# EAGLE design voltage_control (EAGLE 9.0.1)
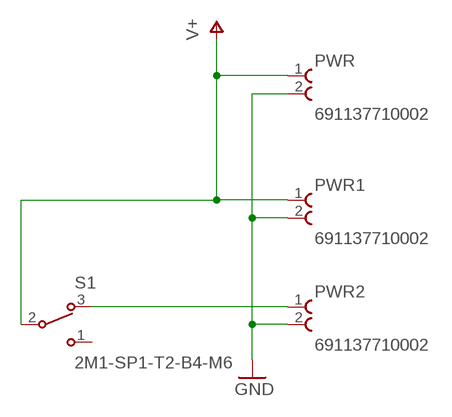
[diagram p0: schematic, sheet 1]

## Parts
PWR  691137710002  [691137710002]
PWR1  691137710002  [691137710002]
PWR2  691137710002  [691137710002]
S1  2M1-SP1-T2-B4-M6  [2M1-SP1-T2-B4-M6]

## Nets
GND: PWR1.2 PWR2.2 PWR.2
N$1: PWR2.1 S1.3(O)
V+: PWR1.1 PWR.1 S1.2(P)
Unconnected: S1.1(S)

## Library data of the parts
PWR PWR1 PWR2 = term block:691137710002: SERIE 1377 - 5.00 MM - HORIZONTAL CABLE ENTRY WITH PRESSURE CLAMP - GLOW WIRE PLASTIC - WR-TBL <http://katalog.we-online.de/media/images/v2/Family_WR-TBL1_6911377100xx.jpg> Details see: http://katalog.we-online.de/en/em/TBL_5_00_1377_HORIZONTAL_ENTRY_W_PRESSURE_CLAMP_GLOW_WIRE_6911377100xx Created by Yingchun,Shan 2016(C) Wurth Elektronik; AVAILABILITY: Unavailable; DESCRIPTION: Term Block 2pos Side Entry 5mm; MF: Wurth Electronics; MP: 691137710002; PACKAGE: None; PRICE: None
S1 = switch-ck:2M1-SP1-T2-B4-M6: TOGGLE SWITCH

## Board
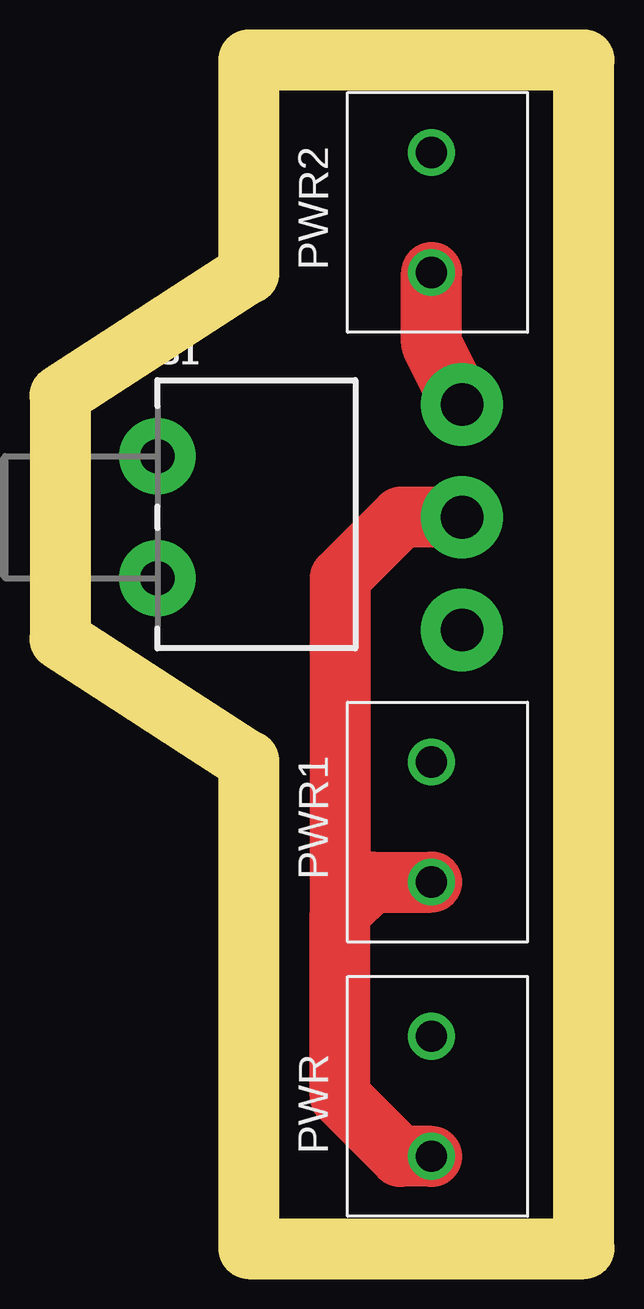
[diagram p1: board, top side]
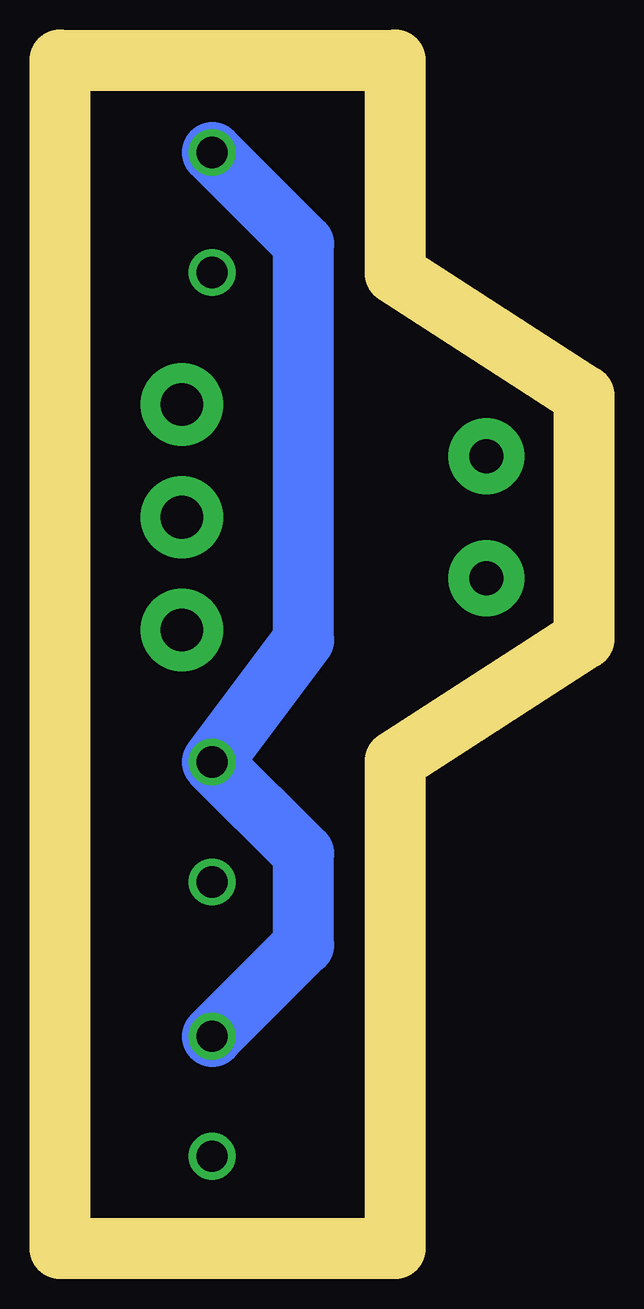
[diagram p2: board, bottom side, seen from below]

Size 21.84 x 49.53 mm. Coordinates in mm from the lower left corner, seen from the top.
Outline: 21.84,0 21.84,49.53 7.87,49.53 7.87,40.64 0,35.56 0,25.4 7.87,20.32 7.87,0 21.84,0
Copper layers (1*16): Top 0.035mm / dielectric 1.5mm / Bottom 0.035mm
Design rules "default": minimum track width 6mil, minimum drill 0.35mm, track to track 6mil, track to pad 6mil, pad to pad 6mil, via to via 6mil, smd to smd 6mil, copper to edge 40mil, drill to drill 6mil, minimum pad ring 10mil, minimum via ring 8mil, stop-mask expansion 4mil, vias tented up to drill 0mil, thermal gap 10mil

### Footprints (pad centres in the part's own frame; a part is rotated, then mirrored left to right if it is on the bottom)
691137710002 = drill 1.3: 1 -2.5,0; 2 2.5,0
2M1-SP1-T2-B4-M6 = drill 1.778 pad 3.429: 1 8.89,-4.699; 2 8.89,0; 3 8.89,4.699 | drill 1.422 pad 3.175: B1 -3.81,-2.54; B2 -3.81,2.54

### Placement (x,y rotation side)
PWR  15.49,6.35 90 top
PWR1  15.49,17.78 90 top
PWR2  15.49,43.18 90 top
S1  7.87,30.48 0 top

### Tracks (layer width: path | path; a pad name or v marks a point on that pad's centre or on a via)
GND
  Bottom 2.54: PWR.2 11.68,12.66 11.68,16.47 PWR1.2 11.68,25.36 11.68,41.87 PWR2.2
N$1
  Top 2.54: S1.3 15.49,37.72 PWR2.1
V+
  Top 2.54: PWR.1 14.18,3.85 11.68,6.35 11.68,13.97 | PWR1.1 12.99,15.28 11.68,13.97 | S1.2 14.22,30.48 11.68,27.94 11.68,13.97